# EAGLE design Target (EAGLE 7.7.0)
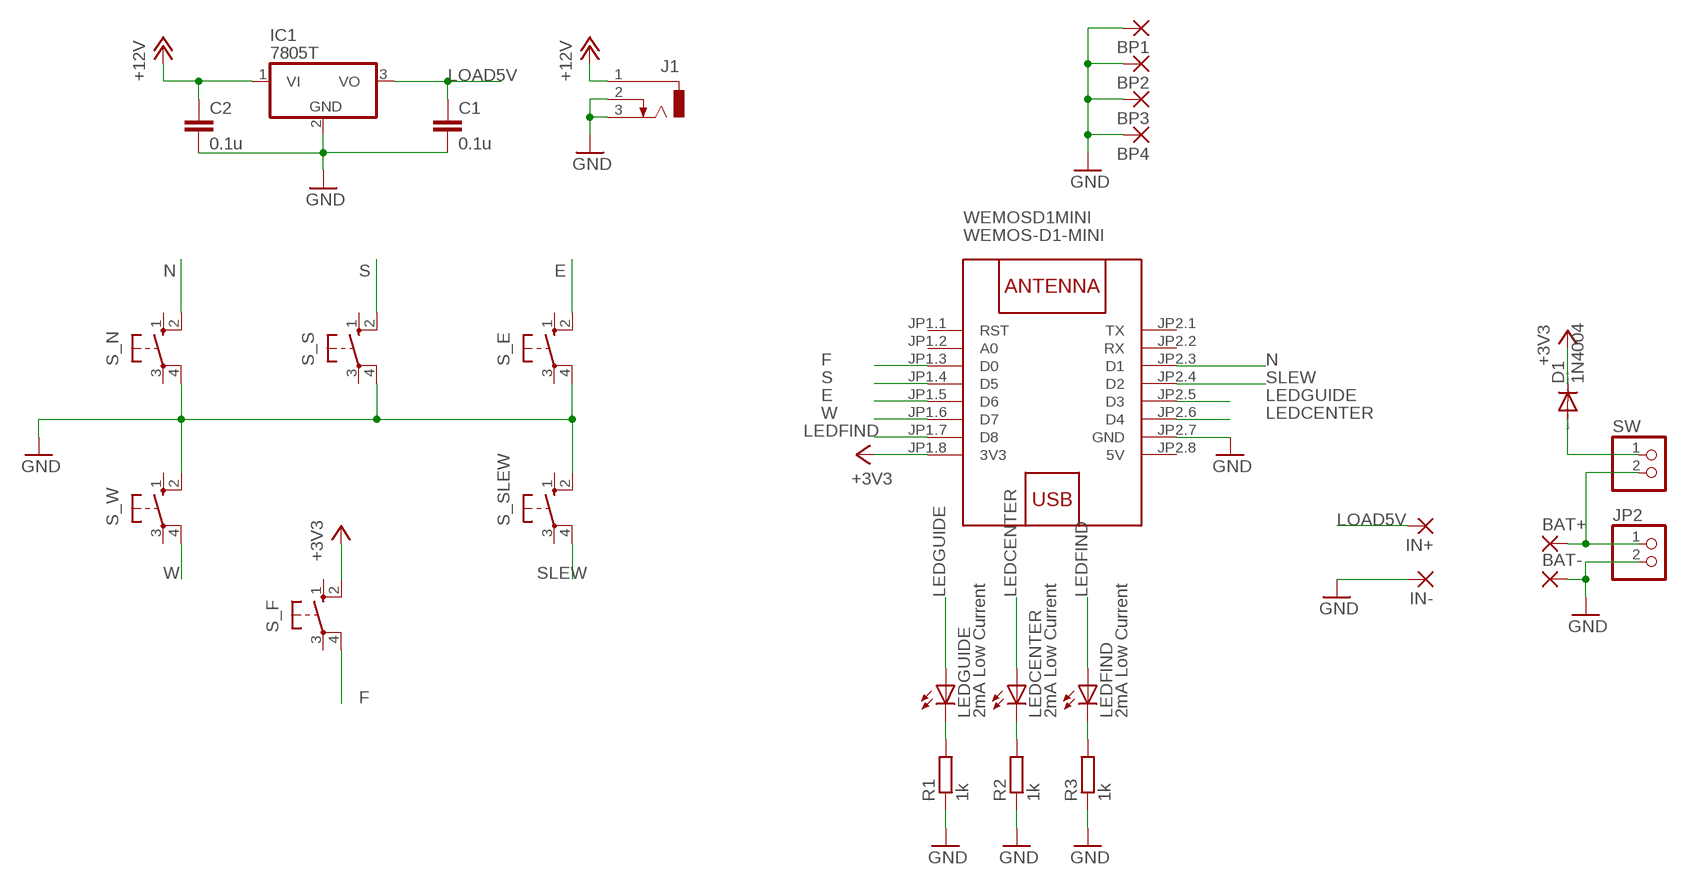
[diagram p0: schematic, sheet 1]

## Parts
BAT+  2,15/1,0  [2,15/1,0]
BAT-  2,15/1,0  [2,15/1,0]
BP1  3,81/1,4  [3,81/1,4]
BP2  3,81/1,4  [3,81/1,4]
BP3  3,81/1,4  [3,81/1,4]
BP4  3,81/1,4  [3,81/1,4]
C1  0.1u  C-EU025_050-025X075  [C025_050-025X075]
C2  0.1u  C-EU025_050-025X075  [C025_050-025X075]
D1  1N4004  [DO41-10]
IC1  7805T  [TO220H]
IN+  2,15/1,0  [2,15/1,0]
IN-  2,15/1,0  [2,15/1,0]
J1  DCJ0303  [DCJ0303]
JP2  PINHD-1X2  [1X02]
LEDCENTER  2mA Low Current  LED3MM  [LED3MM]
LEDFIND  2mA Low Current  LED3MM  [LED3MM]
LEDGUIDE  2mA Low Current  LED3MM  [LED3MM]
R1  1k  R-EU_0204/7  [0204/7]
R2  1k  R-EU_0204/7  [0204/7]
R3  1k  R-EU_0204/7  [0204/7]
S_E  40-XX  [B3F-40XX]
S_F  40-XX  [B3F-40XX]
S_N  40-XX  [B3F-40XX]
S_S  40-XX  [B3F-40XX]
S_SLEW  40-XX  [B3F-40XX]
S_W  40-XX  [B3F-40XX]
SW  PINHD-1X2  [1X02]
WEMOSD1MINI  WEMOS-D1-MINI  [WEMOS-D1-MINI]

## Nets
+3V3: D1.C S_F.2(S1) WEMOSD1MINI.JP1.8(3V3)
+12V [pwr]: C2.1 IC1.1(VI) J1.1
E: S_E.2(S1) WEMOSD1MINI.JP1.5(D6)
F: S_F.4(P1) WEMOSD1MINI.JP1.3(D0)
GND [pwr]: BAT-.1(P) BP1.1(P) BP2.1(P) BP3.1(P) BP4.1(P) C1.2 C2.2 IC1.2(GND) IN-.1(P) J1.2 J1.3 JP2.2 R1.1 R2.1 R3.1 S_E.4(P1) S_N.4(P1) S_S.4(P1) S_SLEW.2(S1) S_W.2(S1) WEMOSD1MINI.JP2.7(GND)
LEDCENTER: LEDCENTER.A WEMOSD1MINI.JP2.6(D4)
LEDFIND: LEDFIND.A WEMOSD1MINI.JP1.7(D8)
LEDGUIDE: LEDGUIDE.A WEMOSD1MINI.JP2.5(D3)
LOAD5V [pwr]: C1.1 IC1.3(VO) IN+.1(P)
N: S_N.2(S1) WEMOSD1MINI.JP2.3(D1)
N$1: LEDGUIDE.K(C) R1.2
N$2: LEDCENTER.K(C) R2.2
N$3: LEDFIND.K(C) R3.2
N$4 [pwr]: BAT+.1(P) JP2.1 SW.2
N$5 [pwr]: D1.A SW.1
S: S_S.2(S1) WEMOSD1MINI.JP1.4(D5)
SLEW: S_SLEW.4(P1) WEMOSD1MINI.JP2.4(D2)
W: S_W.4(P1) WEMOSD1MINI.JP1.6(D7)
Unconnected: S_E.1(S) S_E.3(P) S_F.1(S) S_F.3(P) S_N.1(S) S_N.3(P) S_S.1(S) S_S.3(P) S_SLEW.1(S) S_SLEW.3(P) S_W.1(S) S_W.3(P) WEMOSD1MINI.JP1.1(RST) WEMOSD1MINI.JP1.2(A0) WEMOSD1MINI.JP2.1(TX) WEMOSD1MINI.JP2.2(RX)

## Power pins joined to a net without a drawn wire
5V: WEMOSD1MINI.JP2.8(5V)

## Library data of the parts
BAT+ BAT- IN+ IN- = wirepad:2,15/1,0: THROUGH-HOLE PAD
BP1-BP4 = wirepad:3,81/1,4: THROUGH-HOLE PAD
C1 C2 = rcl:C-EU: CAPACITOR, European symbol
D1 = diode:1N4004: DIODE general purpose rectifier, 1 A
IC1 = linear:78*: Positive VOLTAGE REGULATOR Source: http://cache.national.com/ds/LM/LM78L05.pdf http://www.fairchildsemi.com/ds/LM/LM7805.pdf
J1 = con-jack:DCJ0303: DC POWER JACK Source: DCJ0303.pdf; OC_FARNELL: unknown; OC_NEWARK: unknown
JP2 SW = pinhead:PINHD-1X2: PIN HEADER
LEDCENTER LEDFIND LEDGUIDE = led:LED: LED OSRAM: - CHIPLED LG R971, LG N971, LY N971, LG Q971, LY Q971, LO R971, LY R971 LH N974, LH R974 LS Q976, LO Q976, LY Q976 LO Q996 - Hyper CHIPLED LW Q18S LB Q993, LB Q99A, LB R99A - SideLED LS A670, LO A670, LY A670, LG A670, LP A670 LB A673, LV A673, LT A673, LW A673 LH A674 LY A675 LS A676, LA A676, LO A676, LY A676, LW A676 LS A679, LY A679, LG A679 - Hyper Micro SIDELED® LS Y876, LA Y876, LO Y876, LY Y876 LT Y87S - SmartLED LW L88C, LW L88S LB L89C, LB L89S, LG L890 LS L89K, LO L89K, LY L89K LS L896, LA L896, LO L896, LY L896 - TOPLED LS T670, LO T670, LY T670, LG T670, LP T670 LSG T670, LSP T670, LSY T670, LOP T670, LYG T670 LG T671, LOG T671, LSG T671 LB T673, LV T673, LT T673, LW T673 LH T674 LS T676, LA T676, LO T676, LY T676, LB T676, LH T676, LSB T676, LW T676 LB T67C, LV T67C, LT T67C, LS T67K, LO T67K, LY T67K, LW E67C LS E67B, LA E67B, LO E67B, LY E67B, LB E67C, LV E67C, LT E67C LW T67C LS T679, LY T679, LG T679 LS T770, LO T770, LY T770, LG T770, LP T770 LB T773, LV T773, LT T773, LW T773 LH T774 LS E675, LA E675, LY E675, LS T675 LS T776, LA T776, LO T776, LY T776, LB T776 LHGB T686 LT T68C, LB T68C - Hyper Mini TOPLED® LB M676 - Mini TOPLED Santana® LG M470 LS M47K, LO M47K, LY M47K Source: http://www.osram.convergy.de LUXEON: - LUMILED® LXK2-PW12-R00, LXK2-PW12-S00, LXK2-PW14-U00, LXK2-PW14-V00 LXK2-PM12-R00, LXK2-PM12-S00, LXK2-PM14-U00 LXK2-PE12-Q00, LXK2-PE12-R00, LXK2-PE12-S00, LXK2-PE14-T00, LXK2-PE14-U00 LXK2-PB12-K00, LXK2-PB12-L00, LXK2-PB12-M00, LXK2-PB14-N00, LXK2-PB14-P00, LXK2-PB14-Q00 LXK2-PR12-L00, LXK2-PR12-M00, LXK2-PR14-Q00, LXK2-PR14-R00 LXK2-PD12-Q00, LXK2-PD12-R00, LXK2-PD12-S00 LXK2-PH12-R00, LXK2-PH12-S00 LXK2-PL12-P00, LXK2-PL12-Q00, LXK2-PL12-R00 Source: www.luxeon.com KINGBRIGHT: KA-3528ASYC Source: www.kingbright.com
R1-R3 = rcl:R-EU_: RESISTOR, European symbol
S_E S_F S_N S_S S_SLEW S_W = switch-omron:40-XX: OMRON SWITCH; MF: OMRON COMPONENTS USA; MPN: B3F-4000; OC_FARNELL: 176434; OC_NEWARK: 36K3105
WEMOSD1MINI = diy-modules:WEMOS-D1-MINI: WEMOS D1 mini: Mini Wi-Fi Board based on ESP-8266 device More details can be found here: https://www.wemos.cc/product/d1-mini.html Click here to find device on ebay.com <http://www.ebay.com/sch/wemos+d1+mini+nodemcu>

## Net classes
1 pwr: width 1.016 mm, clearance 0.508 mm

## Board
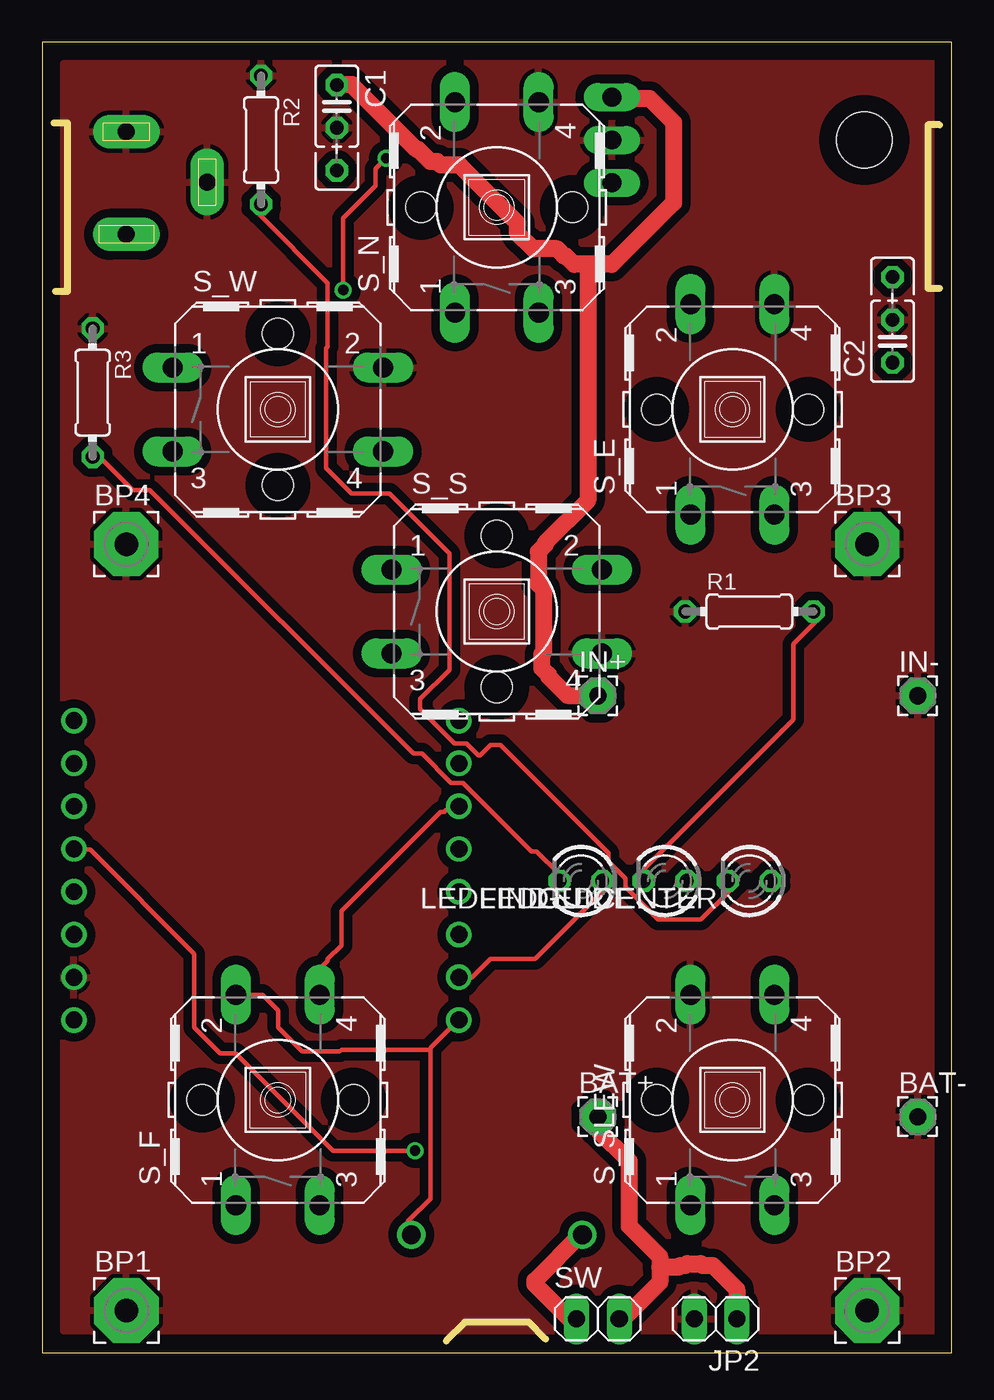
[diagram p1: board, top side]
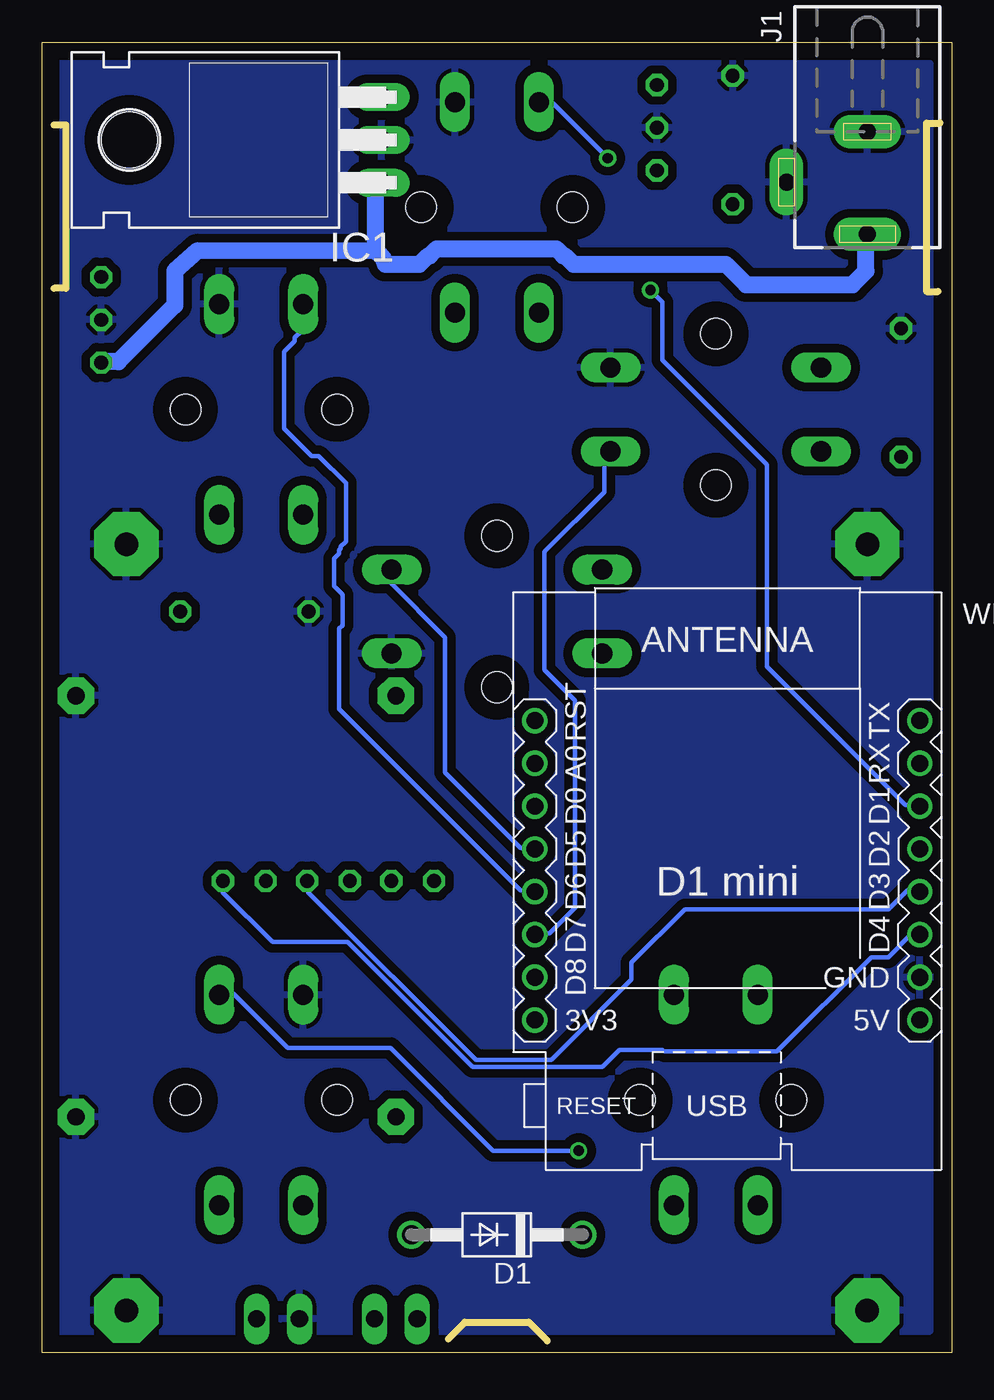
[diagram p2: board, bottom side, seen from below]

Size 54.01 x 77.81 mm. Coordinates in mm from the lower left corner, seen from the top.
Outline: 0,0 54.01,0 54.01,77.81 0,77.81 0,0
Copper layers (1*16): Top 0.035mm / dielectric 1.5mm / Bottom 0.035mm
Design rules "default *": minimum track width 10mil, minimum drill 24mil, track to track 6mil, track to pad 8mil, pad to pad 8mil, via to via 8mil, smd to smd 8mil, copper to edge 40mil, drill to drill 8mil, minimum pad ring 10mil, minimum via ring 8mil, stop-mask expansion 4mil, vias tented up to drill 0mil, thermal gap 10mil
bKeepout: area 36,67 to 53,77
Milling: 9 lines

### Footprints (pad centres in the part's own frame; a part is rotated, then mirrored left to right if it is on the bottom)
2,15/1,0 = drill 1.016 pad 2.159 octagon: 1 0,0
3,81/1,4 = drill 1.397 pad 3.81 octagon: 1 0,0
C025_050-025X075 = drill 0.813 octagon: 1 -1.27,0; 2 1.27,0; 3 3.81,0
DO41-10 = drill 1.118: A 5.08,0; C -5.08,0
TO220H = drill 1.118 long: 1 -2.54,-10.16; 2 0,-10.16; 3 2.54,-10.16 | hole 3.302: 0,4.826
DCJ0303 = drill 1 pad 2 long: 1 0,3.1; 2 4.8,0; 3 0,-3
1X02 = drill 1.016 long: 1 -1.27,0; 2 1.27,0
LED3MM = drill 0.813 octagon: A -1.27,0; K 1.27,0
0204/7 = drill 0.813 octagon: 1 -3.81,0; 2 3.81,0
B3F-40XX = drill 1.194 long: 1 -6.248,2.489; 2 6.248,2.489; 3 -6.248,-2.489; 4 6.248,-2.489 | hole 1.803: 0,-4.496; 0,4.496
WEMOS-D1-MINI = drill 1: JP1.1 -11.43,9.525; JP1.2 -11.43,6.985; JP1.3 -11.43,4.445; JP1.4 -11.43,1.905; JP1.5 -11.43,-0.635; JP1.6 -11.43,-3.175; JP1.7 -11.43,-5.715; JP1.8 -11.43,-8.255; JP2.1 11.43,9.525; JP2.2 11.43,6.985; JP2.3 11.43,4.445; JP2.4 11.43,1.905; JP2.5 11.43,-0.635; JP2.6 11.43,-3.175; JP2.7 11.43,-5.715; JP2.8 11.43,-8.255

### Placement (x,y rotation side)
BAT+  33,14 0 top
BAT-  52,14 0 top
BP1  5.01,2.5 0 top
BP2  49,2.5 0 top
BP3  49,48 0 top
BP4  5,48 0 top
C1  17.5,74 270 top
C2  50.5,60.05 90 top
D1  27,7 180 bottom
IC1  44,72 90 bottom
IN+  33,39 0 top
IN-  52,39 0 top
J1  5,69.5 180 bottom
JP2  40,2 180 top
LEDCENTER  42,28 180 top
LEDFIND  32,28 180 top
LEDGUIDE  37,28 180 top
R1  42,44 0 top
R2  13,72 270 top
R3  3,57 270 top
S_E  41,56 90 top
S_F  14,15 90 top
S_N  27,68 90 top
S_S  27,44 0 top
S_SLEW  41,15 90 top
S_W  14,56 0 top
SW  33,2 0 top
WEMOSD1MINI  13.32,28 0 bottom

### Tracks (layer width: path | path; a pad name or v marks a point on that pad's centre or on a via)
+3V3
  Top 0.254: 23.06,17.98 23.06,9.14 21.74,7.82 21.84,7.72 21.84,7.01 D1.C | 23.06,17.98 23.06,18.09 24.69,19.71 WEMOSD1MINI.JP1.8 | 23.06,17.98 17.78,17.98 17.68,17.88 15.44,17.88 14.02,19.3 14.02,20.32 13.11,21.23 11.58,21.23 S_F.2
+12V
  Bottom 1.016: 34.24,65.4 44.77,65.43 46.13,64.21 46.13,62.18 49.48,58.83 50.49,58.83 C2.1 | 34.24,65.4 34.24,69.39 33.93,69.39 IC1.1 | J1.1 5.08,66.34 5.08,64.21 5.89,63.4 12.19,63.4 13.41,64.62 22.45,64.62 22.96,65.13 23.06,65.13 23.47,65.53 30.58,65.53 30.99,65.13 31.09,65.13 31.6,64.62 33.63,64.62 33.84,65.1 34.24,65.4
E
  Bottom 0.254: WEMOSD1MINI.JP1.5 24.79,27.43 25.6,27.43 36.37,38.2 36.37,42.98 36.17,43.18 36.17,45.01 36.68,45.52 36.68,47.14 36.37,47.45 36.37,47.65 36.27,47.75 36.27,47.85 35.97,48.16 35.97,51.61 37.59,53.24 38,53.24 39.62,54.86 39.62,59.44 39.01,60.05 39.01,60.25 38.61,60.66 38.61,62.18 S_E.2
F
  Top 0.254: WEMOSD1MINI.JP1.3 24.69,32.41 24.18,32.41 23.88,32.11 23.67,32.11 17.78,26.21 17.78,24.18 16.97,23.37 16.97,23.27 16.56,22.86 16.56,21.34 S_F.4
GND
  pour Bottom: 1.27,76.55 53.07,76.55 53.07,1.27 1.27,1.27
  pour Top: 1.27,76.55 53.07,76.55 53.07,1.27 1.27,1.27
LEDCENTER
  Bottom 0.254: LEDCENTER.A 43.28,27.94 43.28,27.33 40.34,24.38 35.87,24.38 28.45,16.97 20.73,16.97 19.71,17.98 17.17,17.98 17.07,17.88 10.36,17.88 4.78,23.47 3.76,23.47 2.44,24.79 1.93,24.79 WEMOSD1MINI.JP2.6
LEDFIND
  Top 0.254: LEDFIND.A 33.22,27.94 33.22,27.33 29.26,23.37 26.62,23.37 25.5,22.25 24.79,22.25 WEMOSD1MINI.JP1.7
LEDGUIDE
  Bottom 0.254: LEDGUIDE.A 38.2,27.94 38.2,27.33 28.25,17.37 23.77,17.37 19,22.15 19,23.16 15.85,26.31 3.76,26.31 2.64,27.43 1.93,27.43 WEMOSD1MINI.JP2.5
LOAD5V
  Top 1.016: 32.41,64.62 33.83,64.62 37.49,68.28 37.49,73.05 36.07,74.47 33.93,74.47 IC1.3 | 32.41,64.62 31.6,64.62 31.09,65.13 30.99,65.13 30.58,65.53 29.16,65.53 28.25,66.45 28.25,67.06 24.79,70.51 23.67,70.51 23.47,70.71 23.06,70.71 22.35,71.42 22.25,71.42 18.39,75.29 17.58,75.29 C1.1 | 32.41,64.62 32.41,50.6 29.87,48.06 29.87,47.95 29.46,47.55 29.46,45.62 29.77,45.31 29.77,41.55 29.67,41.45 29.67,40.64 30.07,40.23 30.07,40.13 31.19,39.01 32.92,39.01 IN+.1
N  (via drill 0.61)
  Top 0.254: v17.88,63.09 17.88,67.36 19.81,69.29 19.81,70.31 v20.42,70.92
  Bottom 0.254: v17.88,63.09 17.17,62.38 17.17,58.93 10.97,52.73 10.97,40.74 2.74,32.51 1.93,32.51 WEMOSD1MINI.JP2.3 | v20.42,70.92 23.67,74.17 24.49,74.17 S_N.2
N$1
  Top 0.254: LEDGUIDE.K 35.76,28.04 35.76,28.75 44.6,37.59 44.6,42.06 45.92,43.38 45.92,43.89 45.82,43.99 R1.2
N$2
  Top 0.254: LEDCENTER.K 40.74,27.94 40.74,27.33 39.12,25.7 36.58,25.7 34.65,27.64 34.65,28.14 33.63,29.16 33.63,29.67 27.23,36.07 26.62,36.07 26.01,35.46 25.91,35.46 25.2,36.17 24.49,36.17 22.45,38.2 22.45,38.81 24.18,40.54 24.18,47.45 20.62,51 18.39,51 16.87,52.53 16.87,59.64 16.97,59.74 16.97,63.5 12.9,67.56 12.9,68.17 R2.2
N$3
  Top 0.254: R3.2 3.05,53.14 3.45,53.14 5.38,51.21 6.4,51.21 22.05,35.56 22.55,35.56 24.28,33.83 24.99,33.83 29.06,29.77 29.36,29.77 30.68,28.45 30.68,28.04 LEDFIND.K
N$4
  Top 1.016: 36.68,5.08 36.68,5.69 34.85,7.52 34.85,11.38 33.02,13.21 33.02,13.92 BAT+.1 | 36.68,5.08 36.68,4.17 34.54,2.03 34.34,2.03 SW.2 | 36.68,5.08 37.8,5.08 37.9,5.18 38.2,5.18 38.3,5.28 39.12,5.28 39.22,5.18 39.83,5.18 41.25,3.76 41.25,2.03 JP2.1
N$5
  Top 1.016: SW.1 31.7,2.03 31.29,2.03 29.26,4.06 29.26,4.27 32,7.01 D1.A
S
  Bottom 0.254: WEMOSD1MINI.JP1.4 24.79,29.97 25.6,29.97 30.07,34.44 30.07,42.47 33.33,45.72 33.33,46.43 S_S.2
SLEW  (via drill 0.61)
  Top 0.254: v22.15,11.99 17.27,11.99 11.48,17.78 10.57,17.78 9.04,19.3 9.04,23.67 2.85,29.87 1.93,29.87 WEMOSD1MINI.JP2.4
  Bottom 0.254: v22.15,11.99 27.23,11.99 33.33,18.09 39.42,18.09 42.67,21.34 43.48,21.34 S_SLEW.4
W
  Bottom 0.254: WEMOSD1MINI.JP1.6 24.69,24.89 23.88,24.89 22.35,26.42 22.35,38.71 24.18,40.54 24.18,47.55 20.62,51.1 20.62,53.14 20.32,53.44 S_W.4